# EasyEDA schematic 1M Linear Paged RAM ROM V3.0.json
TITLE: 1M Linear/Paged RAM/ROM; REV: 3.0; Date: 2019-10-14; Sheet: 1/1; Drawn By: robdobsn; Company: Rob Dobson
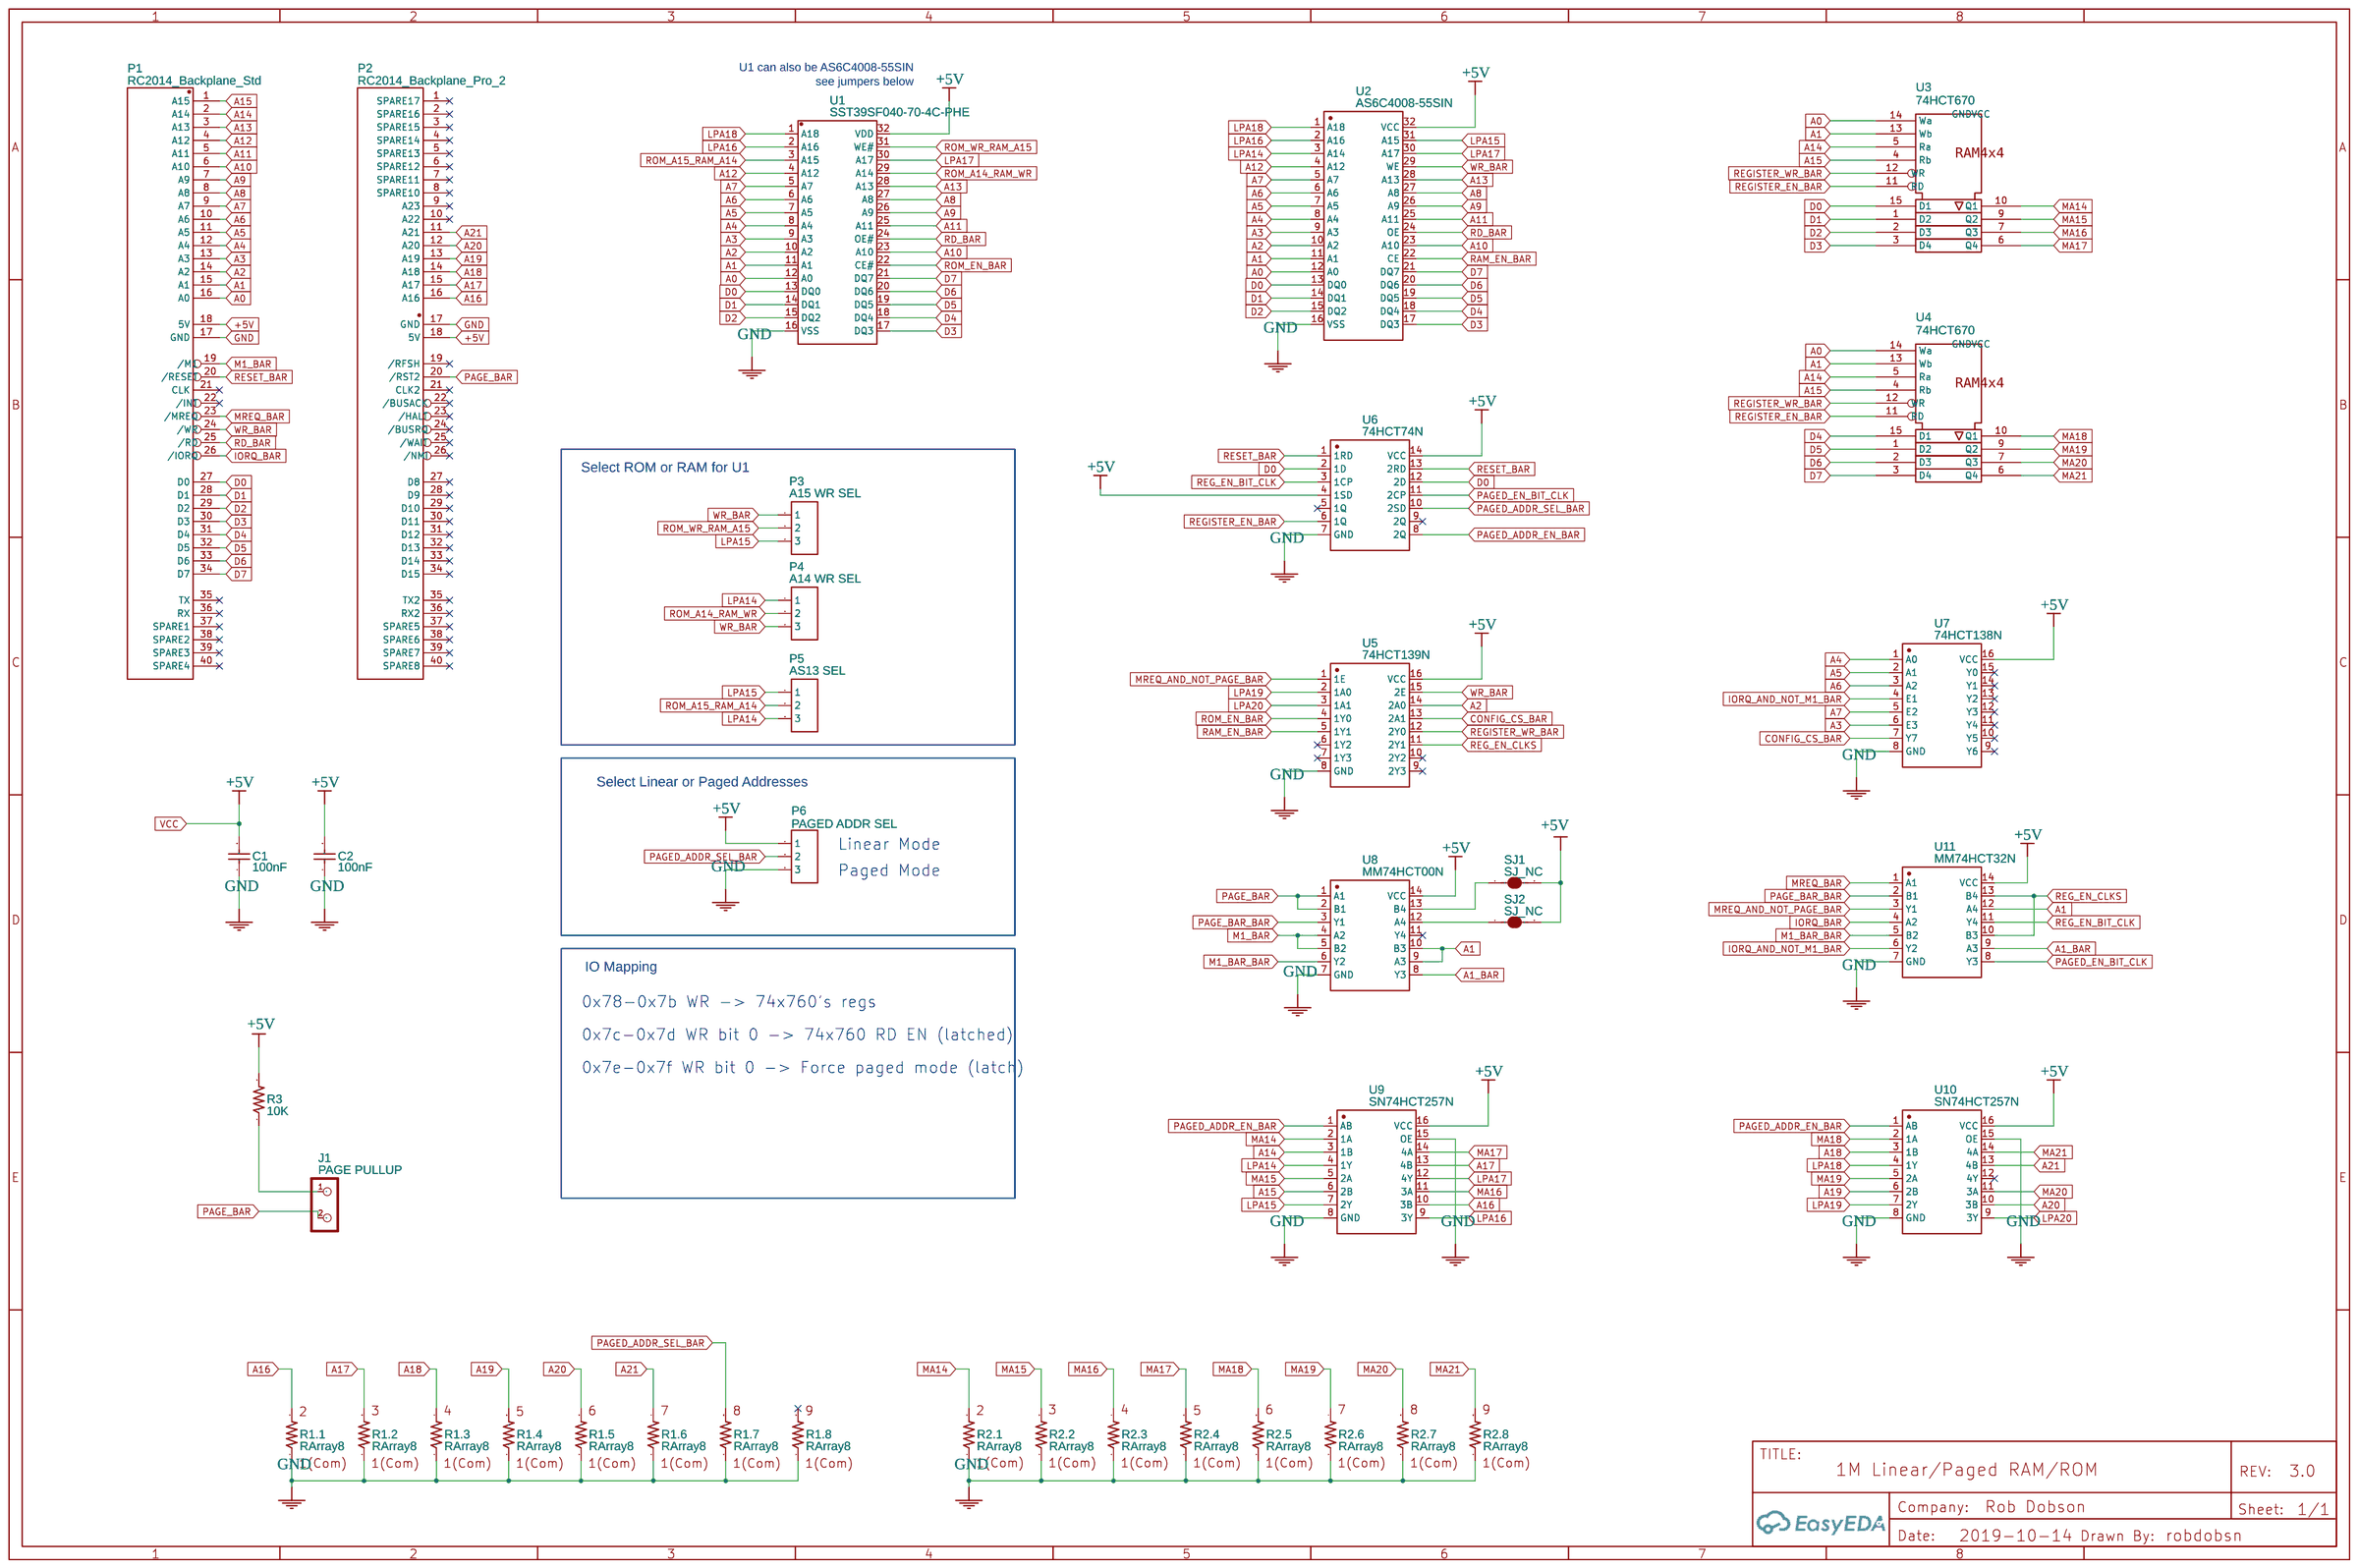
[diagram p0: schematic sheet]

## Parts
C1  100nF  [PKG-CERAMIC CAPACITOR 6X2]
C2  100nF  [PKG-CERAMIC CAPACITOR 6X2]
J1  PAGE PULLUP  [1X02_HEADER_2_54_THRU_NO_SILK]
P1  RC2014_Backplane_Std  [HDR-2.54-1X40P]
P2  RC2014_Backplane_Pro_2  [HDR-2.54-1X40P]
P3  A15 WR SEL  [HDR-3X1/2.54_09MMHOLES]
P4  A14 WR SEL  [HDR-3X1/2.54_09MMHOLES]
P5  AS13 SEL  [HDR-3X1/2.54_09MMHOLES]
P6  PAGED ADDR SEL  [HDR-3X1/2.54_09MMHOLES]
R1  RArray8  [RESISTOR_ARRAY_SIP_9]  (sections 1,2,3,4,5,6,7,8)
R2  RArray8  [RESISTOR_ARRAY_SIP_9]  (sections 1,2,3,4,5,6,7,8)
R3  10K  [RESISTOR 1/4W]
SJ1  SJ_NC  [SJ_NC]
SJ2  SJ_NC  [SJ_NC]
U1  SST39SF040-70-4C-PHE  [DIP32]
U2  AS6C4008-55SIN  [DIP32]
U3  74HCT670  [DIP16]
U4  74HCT670  [DIP16]
U5  74HCT139N  [DIP16]
U6  74HCT74N  [DIP14]
U7  74HCT138N  [DIP16]
U8  MM74HCT00N  [DIP14]
U9  SN74HCT257N  [DIP16]
U10  SN74HCT257N  [DIP16]
U11  MM74HCT32N  [DIP14]

## Library data of the parts
C1 C2 = -: Voltage: 100V; Tolerance: ±20%; Supplier Part: 9411887; Supplier: Element14; Manufacturer Part: MCFYU6104Z6; Contributor: Prof. Ing. F. Scordino; Link: http://www.farnell.com/datasheets/296858.pdf?_ga=2.179112227.664711881.1510158588-238689616.1505921947&_gac=1.162203016.1510158588.EAIaIQobChMIqoD3jrOv1wIVgwrTCh2CCwl7EAAYASAAEgKQo_D_BwE
J1 = -: Contributor: robdobsn
P1 = -: Supplier Part: C74252; Supplier: LCSC; Contributor: robdobsn; Manufacturer Part: ?
P2 = -: Supplier Part: C74252; Contributor: robdobsn; Manufacturer Part: ?
P3-P6 = -: Supplier: LCSC; Manufacturer: BOOMELE; Manufacturer Part: Header2.54mm 1*3P; image: //image.lceda.cn/szlcsc/C49257.jpg; Supplier Part: C49257; Contributor: robdobsn
R1 R2 = -: Contributor: robdobsn; Supplier Part: 652-4609X-1LF-10K; Supplier: Mouser; Manufacturer: Bourns; Manufacturer Part: 4609X-101-103LF; subpart_no: 1; Package Display: No
R3 = -: Contributor: SparkFun; Manufacturer Part: ?
SJ1 SJ2 = -: Solder Jumper; Contributor: robdobsn
U1 = -: Supplier: LCSC; Supplier Part: C220176; Manufacturer: Microchip Tech; Contributor: robdobsn
U2 U5 = -: Contributor: robdobsn; Manufacturer Part: ?
U3 U4 = -: Contributor: robdobsn; license: https://www.gnu.org/licenses/lgpl-2.1.html; Manufacturer Part: ?
U6 U7 = -: Manufacturer Part: ?

## Nets
+5V: C1.2 C2.2 P1.18(5V) P2.18(5V) P6.1 R3.2 SJ1.2 SJ2.2 U1.32(VDD) U2.32(VCC) U5.16(VCC) U6.4(1SD) U6.14(VCC) U7.16(VCC) U8.14(VCC) U9.16(VCC) U10.16(VCC) U11.14(VCC)
GND: C1.1 C2.1 P1.17(GND) P2.17(GND) P6.3 R1.1 R2.1 U1.16(VSS) U2.16(VSS) U5.8(GND) U6.7(GND) U7.8(GND) U8.7(GND) U9.8(GND) U9.15(OE) U10.8(GND) U10.15(OE) U11.7(GND)
A0: P1.16(A0) U1.12(A0) U2.12(A0) U3.14(Wa) U4.14(Wa)
A1: P1.15(A1) U1.11(A1) U2.11(A1) U3.13(Wb) U4.13(Wb) U8.9(A3) U8.10(B3) U11.12(A4)
A1_BAR: U8.8(Y3) U11.9(A3)
A2: P1.14(A2) U1.10(A2) U2.10(A2) U5.14(2A0)
A3: P1.13(A3) U1.9(A3) U2.9(A3) U7.6(E3)
A4: P1.12(A4) U1.8(A4) U2.8(A4) U7.1(A0)
A5: P1.11(A5) U1.7(A5) U2.7(A5) U7.2(A1)
A6: P1.10(A6) U1.6(A6) U2.6(A6) U7.3(A2)
A7: P1.9(A7) U1.5(A7) U2.5(A7) U7.5(E2)
A8: P1.8(A8) U1.27(A8) U2.27(A8)
A9: P1.7(A9) U1.26(A9) U2.26(A9)
A10: P1.6(A10) U1.23(A10) U2.23(A10)
A11: P1.5(A11) U1.25(A11) U2.25(A11)
A12: P1.4(A12) U1.4(A12) U2.4(A12)
A13: P1.3(A13) U1.28(A13) U2.28(A13)
A14: P1.2(A14) U3.5(Ra) U4.5(Ra) U9.3(1B)
A15: P1.1(A15) U3.4(Rb) U4.4(Rb) U9.6(2B)
A16: P2.16(A16) R1.2 U9.10(3B)
A17: P2.15(A17) R1.3 U9.13(4B)
A18: P2.14(A18) R1.4 U10.3(1B)
A19: P2.13(A19) R1.5 U10.6(2B)
A20: P2.12(A20) R1.6 U10.10(3B)
A21: P2.11(A21) R1.7 U10.13(4B)
CONFIG_CS_BAR: U5.13(2A1) U7.7(Y7)
D0: P1.27(D0) U1.13(DQ0) U2.13(DQ0) U3.15(D1) U6.2(1D) U6.12(2D)
D1: P1.28(D1) U1.14(DQ1) U2.14(DQ1) U3.1(D2)
D2: P1.29(D2) U1.15(DQ2) U2.15(DQ2) U3.2(D3)
D3: P1.30(D3) U1.17(DQ3) U2.17(DQ3) U3.3(D4)
D4: P1.31(D4) U1.18(DQ4) U2.18(DQ4) U4.15(D1)
D5: P1.32(D5) U1.19(DQ5) U2.19(DQ5) U4.1(D2)
D6: P1.33(D6) U1.20(DQ6) U2.20(DQ6) U4.2(D3)
D7: P1.34(D7) U1.21(DQ7) U2.21(DQ7) U4.3(D4)
IORQ_AND_NOT_M1_BAR: U7.4(E1) U11.6(Y2)
IORQ_BAR: P1.26(/IORQ) U11.4(A2)
LPA14: P4.1 P5.3 U2.3(A14) U9.4(1Y)
LPA15: P3.3 P5.1 U2.31(A15) U9.7(2Y)
LPA16: U1.2(A16) U2.2(A16) U9.9(3Y)
LPA17: U1.30(A17) U2.30(A17) U9.12(4Y)
LPA18: U1.1(A18) U2.1(A18) U10.4(1Y)
LPA19: U5.2(1A0) U10.7(2Y)
LPA20: U5.3(1A1) U10.9(3Y)
M1_BAR: P1.19(/M1) U8.4(A2) U8.5(B2)
M1_BAR_BAR: U8.6(Y2) U11.5(B2)
MA14: R2.2 U3.10(Q1) U9.2(1A)
MA15: R2.3 U3.9(Q2) U9.5(2A)
MA16: R2.4 U3.7(Q3) U9.11(3A)
MA17: R2.5 U3.6(Q4) U9.14(4A)
MA18: R2.6 U4.10(Q1) U10.2(1A)
MA19: R2.7 U4.9(Q2) U10.5(2A)
MA20: R2.8 U4.7(Q3) U10.11(3A)
MA21: R2.9 U4.6(Q4) U10.14(4A)
MREQ_AND_NOT_PAGE_BAR: U5.1(1E) U11.3(Y1)
MREQ_BAR: P1.23(/MREQ) U11.1(A1)
PAGE_BAR: J1.2 P2.20(/RST2) U8.1(A1) U8.2(B1)
PAGE_BAR_BAR: U8.3(Y1) U11.2(B1)
PAGED_ADDR_EN_BAR: U6.8(2Q) U9.1(AB) U10.1(AB)
PAGED_ADDR_SEL_BAR: P6.2 R1.8 U6.10(2SD)
PAGED_EN_BIT_CLK: U6.11(2CP) U11.8(Y3)
RAM_EN_BAR: U2.22(CE) U5.5(1Y1)
RD_BAR: P1.25(/RD) U1.24(OE#) U2.24(OE)
REG_EN_BIT_CLK: U6.3(1CP) U11.11(Y4)
REG_EN_CLKS: U5.11(2Y1) U11.10(B3) U11.13(B4)
REGISTER_EN_BAR: U3.11(RD) U4.11(RD) U6.6(1Q)
REGISTER_WR_BAR: U3.12(WR) U4.12(WR) U5.12(2Y0)
RESET_BAR: P1.20(/RESET) U6.1(1RD) U6.13(2RD)
ROM_A14_RAM_WR: P4.2 U1.29(A14)
ROM_A15_RAM_A14: P5.2 U1.3(A15)
ROM_EN_BAR: U1.22(CE#) U5.4(1Y0)
ROM_WR_RAM_A15: P3.2 U1.31(WE#)
WR_BAR: P1.24(/WR) P3.1 P4.3 U2.29(WE) U5.15(2E)
Net-(J1-1): J1.1 R3.1
Net-(SJ1-1): SJ1.1 U8.13(B4)
Net-(SJ2-1): SJ2.1 U8.12(A4)

Not connected (* = marked no-connect by the designer): P1 21(CLK)* 22(/INT)* 35(TX)* 36(RX)* 37(SPARE1)* 38(SPARE2)* 39(SPARE3)* 40(SPARE4)*; P2 1(SPARE17)* 2(SPARE16)* 3(SPARE15)* 4(SPARE14)* 5(SPARE13)* 6(SPARE12)* 7(SPARE11)* 8(SPARE10)* 9(A23)* 10(A22)* 19(/RFSH)* 21(CLK2)* 22(/BUSACK)* 23(/HALT)* 24(/BUSRQ)* 25(/WAIT)* 26(/NMI)* 27(D8)* 28(D9)* 29(D10)* 30(D11)* 31(D12)* 32(D13)* 33(D14)* 34(D15)* 35(TX2)* 36(RX2)* 37(SPARE5)* 38(SPARE6)* 39(SPARE7)* 40(SPARE8)*; R1 9*; U3 8(GND) 16(VCC); U4 8(GND) 16(VCC); U5 6(1Y2)* 7(1Y3)* 9(2Y3)* 10(2Y2)*; U6 5(1Q)* 9(2Q)*; U7 9(Y6)* 10(Y5)* 11(Y4)* 12(Y3)* 13(Y2)* 14(Y1)* 15(Y0)*; U8 11(Y4)*; U10 12(4Y)*

## Notes on the sheet
- U1 can also be AS6C4008-55SIN
  see jumpers below
- Select ROM or RAM for U1
- Select Linear or Paged Addresses
- Linear Mode
- Paged Mode
- IO Mapping
- 0x78-0x7b WR -> 74x760's regs
- 0x7c-0x7d WR bit 0 -> 74x760 RD EN (latched)
- 0x7e-0x7f WR bit 0 -> Force paged mode (latch)
